# EAGLE design OBD-UART-ng (EAGLE 9.6.2)
DESCRIPTION: microOBD 200 OBD-II Module; HW_REV: 1.4; PCB_REV: C; PCB_SPEC1: Layer Count: 4; PCB_SPEC2: Size: 1.3" x 0.59"; PCB_SPEC3: Finish Thickness: 0.049" - 0.052"; PCB_SPEC4: Copper Weight: 1oz; TITLE: STM1120

## Sheet 1 of 5
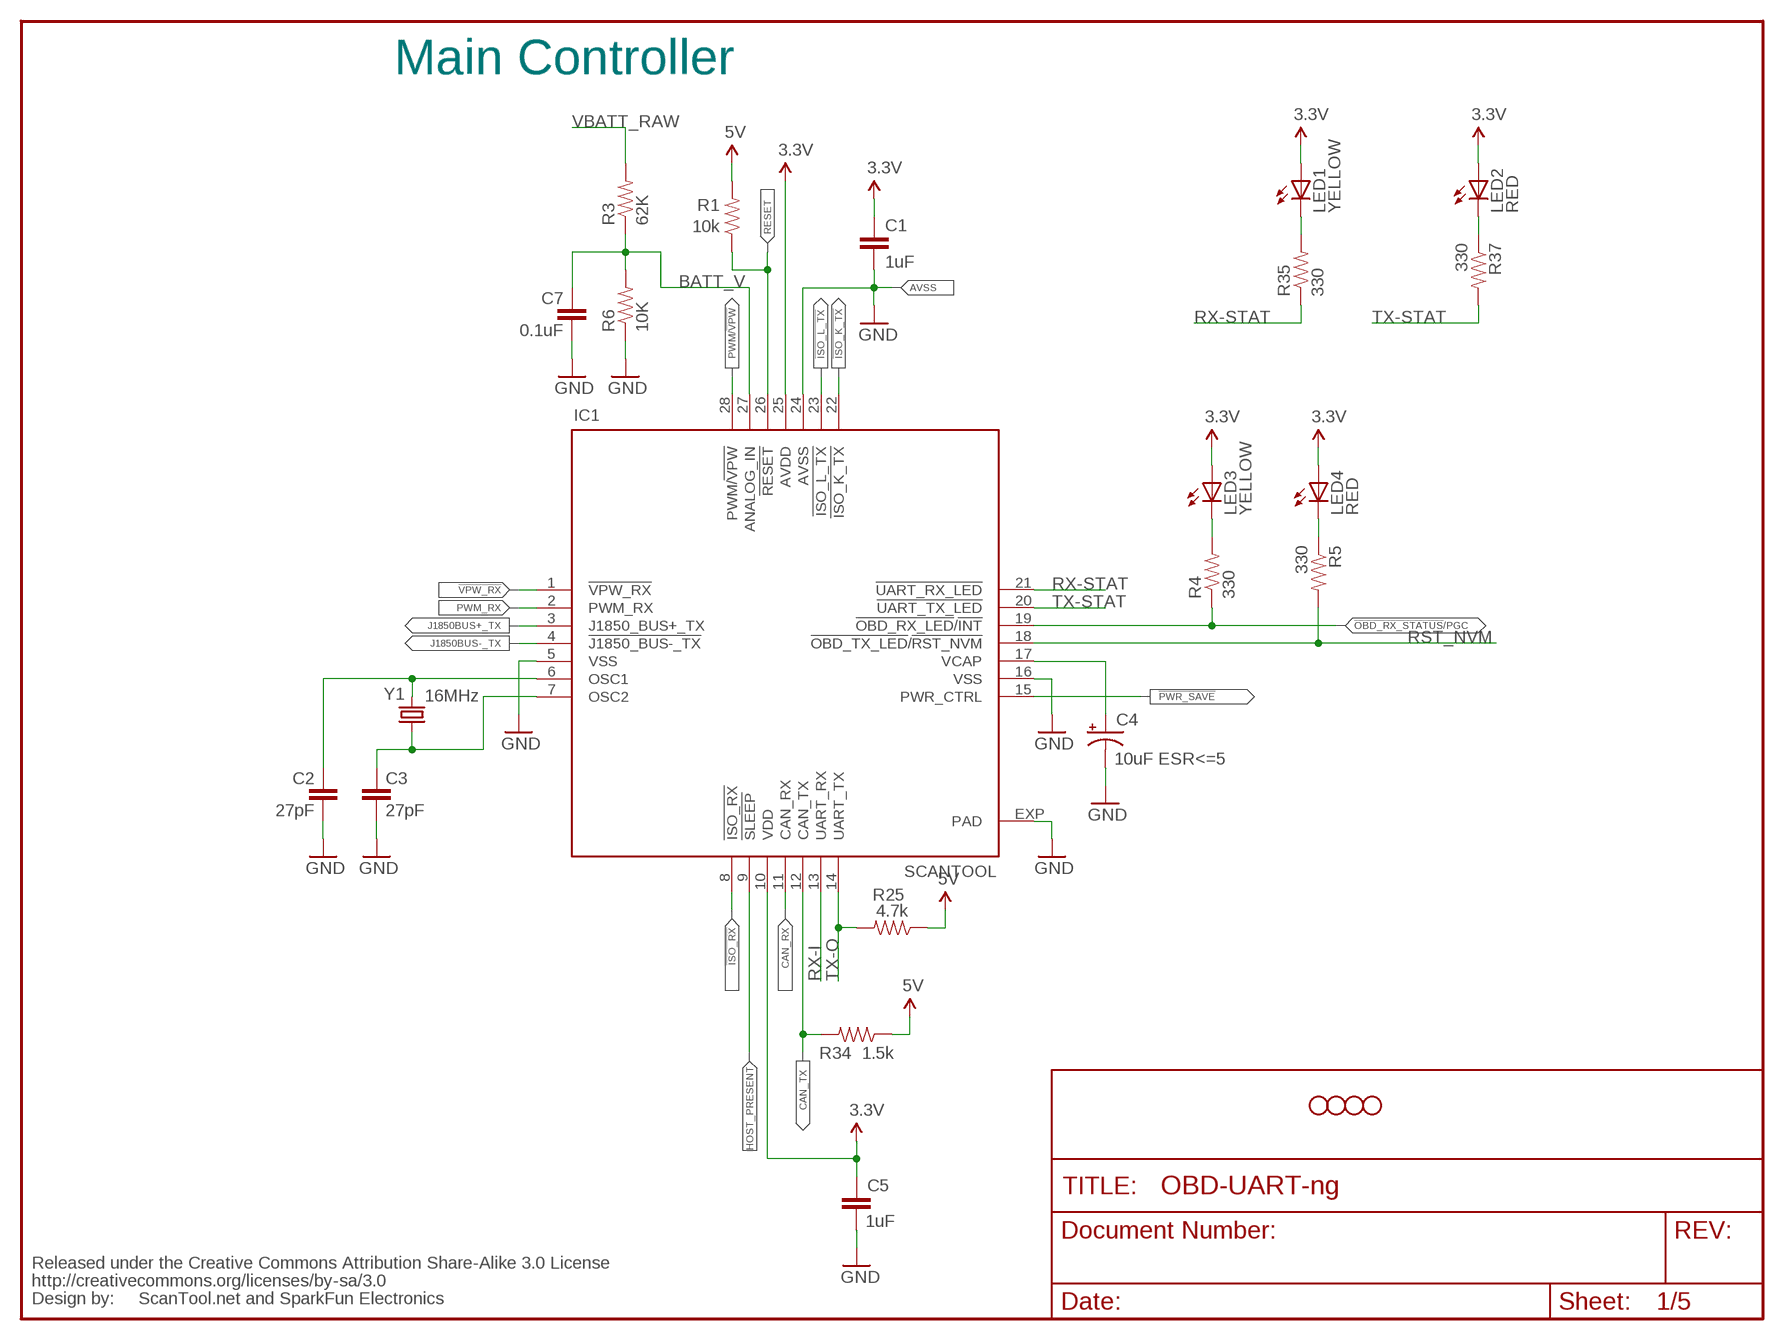
[diagram p0: schematic, sheet 1]

### Parts
C1  1uF  CAP0402-CAP  [0402-CAP]
C2  27pF  CAP0402-CAP  [0402-CAP]
C3  27pF  CAP0402-CAP  [0402-CAP]
C4  10uF ESR<=5  CAP_POL1206  [EIA3216]
C5  1uF  CAP0402-CAP  [0402-CAP]
C7  0.1uF  CAP0402-CAP  [0402-CAP]
IC1  SCANTOOL  [_STN_SCANTOOL_QFN-28-S]
JP4  STAND-OFF  [STAND-OFF]
JP5  STAND-OFF  [STAND-OFF]
JP6  STAND-OFF  [STAND-OFF]
JP7  STAND-OFF  [STAND-OFF]
LED1  YELLOW  LED0603  [LED-0603]
LED2  RED  LED0603  [LED-0603]
LED3  YELLOW  LED0603  [LED-0603]
LED4  RED  LED0603  [LED-0603]
R1  10k  RESISTOR0402-RES  [0402-RES]
R3  62K  RESISTOR0402-RES  [0402-RES]
R4  330  RESISTOR0402-RES  [0402-RES]
R5  330  RESISTOR0402-RES  [0402-RES]
R6  10K  RESISTOR0402-RES  [0402-RES]
R25  4.7k  RESISTOR0402-RES  [0402-RES]
R34  1.5k  RESISTOR0402-RES  [0402-RES]
R35  330  RESISTOR0402-RES  [0402-RES]
R37  330  RESISTOR0402-RES  [0402-RES]
U$1  CREATIVE_COMMONS  [CREATIVE_COMMONS]
Y1  16MHz  CRYSTAL5X3  [CRYSTAL-SMD-5X3]

### Nets
3.3V [highpower]: C1.1 C5.1 IC1.10(VDD) IC1.25(AVDD) LED1.A LED2.A LED3.A LED4.A ; also sheet 2,3,4,5
5V [highpower]: R1.2 R25.1 R34.1 ; also sheet 2,3,4
!ISO_K_TX: IC1.22(!ISO_K_TX) ; also sheet 3
!ISO_L_TX: IC1.23(!ISO_L_TX) ; also sheet 3
!ISO_RX: IC1.8(!ISO_RX) ; also sheet 3
!OBD_RX_STATUS!/PGC: IC1.19(!OBD_RX_LED!/!INT) R4.1
!PWR_SAVE: IC1.15(PWR_CTRL)
!VPW_RX: IC1.1(!VPW_RX) ; also sheet 4
BATT_V [highpower]: C7.1 IC1.27(ANALOG_IN) R3.1 R6.2
CAN_RX: IC1.11(CAN_RX) ; also sheet 3
CAN_TX: IC1.12(CAN_TX) R34.2 ; also sheet 3
GND: C1.2 C2.2 C3.2 C4.C(-) C5.2 C7.2 IC1.5(VSS) IC1.16(VSS) IC1.24(AVSS) IC1.EXP(PAD) R6.1 ; also sheet 2,3,4,5
HOST_PRESENT: IC1.9(!SLEEP)
J1850BUS+_TX: IC1.3(J1850_BUS+_TX) ; also sheet 4
J1850BUS-_TX: IC1.4(!J1850_BUS-_TX) ; also sheet 4
N$26: C4.A(+) IC1.17(VCAP)
N$30: LED3.C R4.2
N$31: LED4.C R5.1
N$35: LED1.C R35.2
N$36: LED2.C R37.1
OSC1: C2.1 IC1.6(OSC1) Y1.3
OSC2: C3.1 IC1.7(OSC2) Y1.1
PWM/!VPW: IC1.28(PWM/!VPW) ; also sheet 4
PWM_RX: IC1.2(PWM_RX) ; also sheet 4
RESET: IC1.26(!RESET) R1.1
RST_NVM: IC1.18(!OBD_TX_LED!/!RST_NVM) R5.2
RX-I: IC1.13(UART_RX) ; also sheet 2
RX-STAT: IC1.21(!UART_RX_LED) R35.1
TX-O: IC1.14(UART_TX) R25.2 ; also sheet 2
TX-STAT: IC1.20(!UART_TX_LED) R37.2
VBATT_RAW [highpower]: R3.2 ; also sheet 2

### Notes on the sheet
- Main Controller
- AVSS
- ScanTool.net and SparkFun Electronics

## Sheet 2 of 5
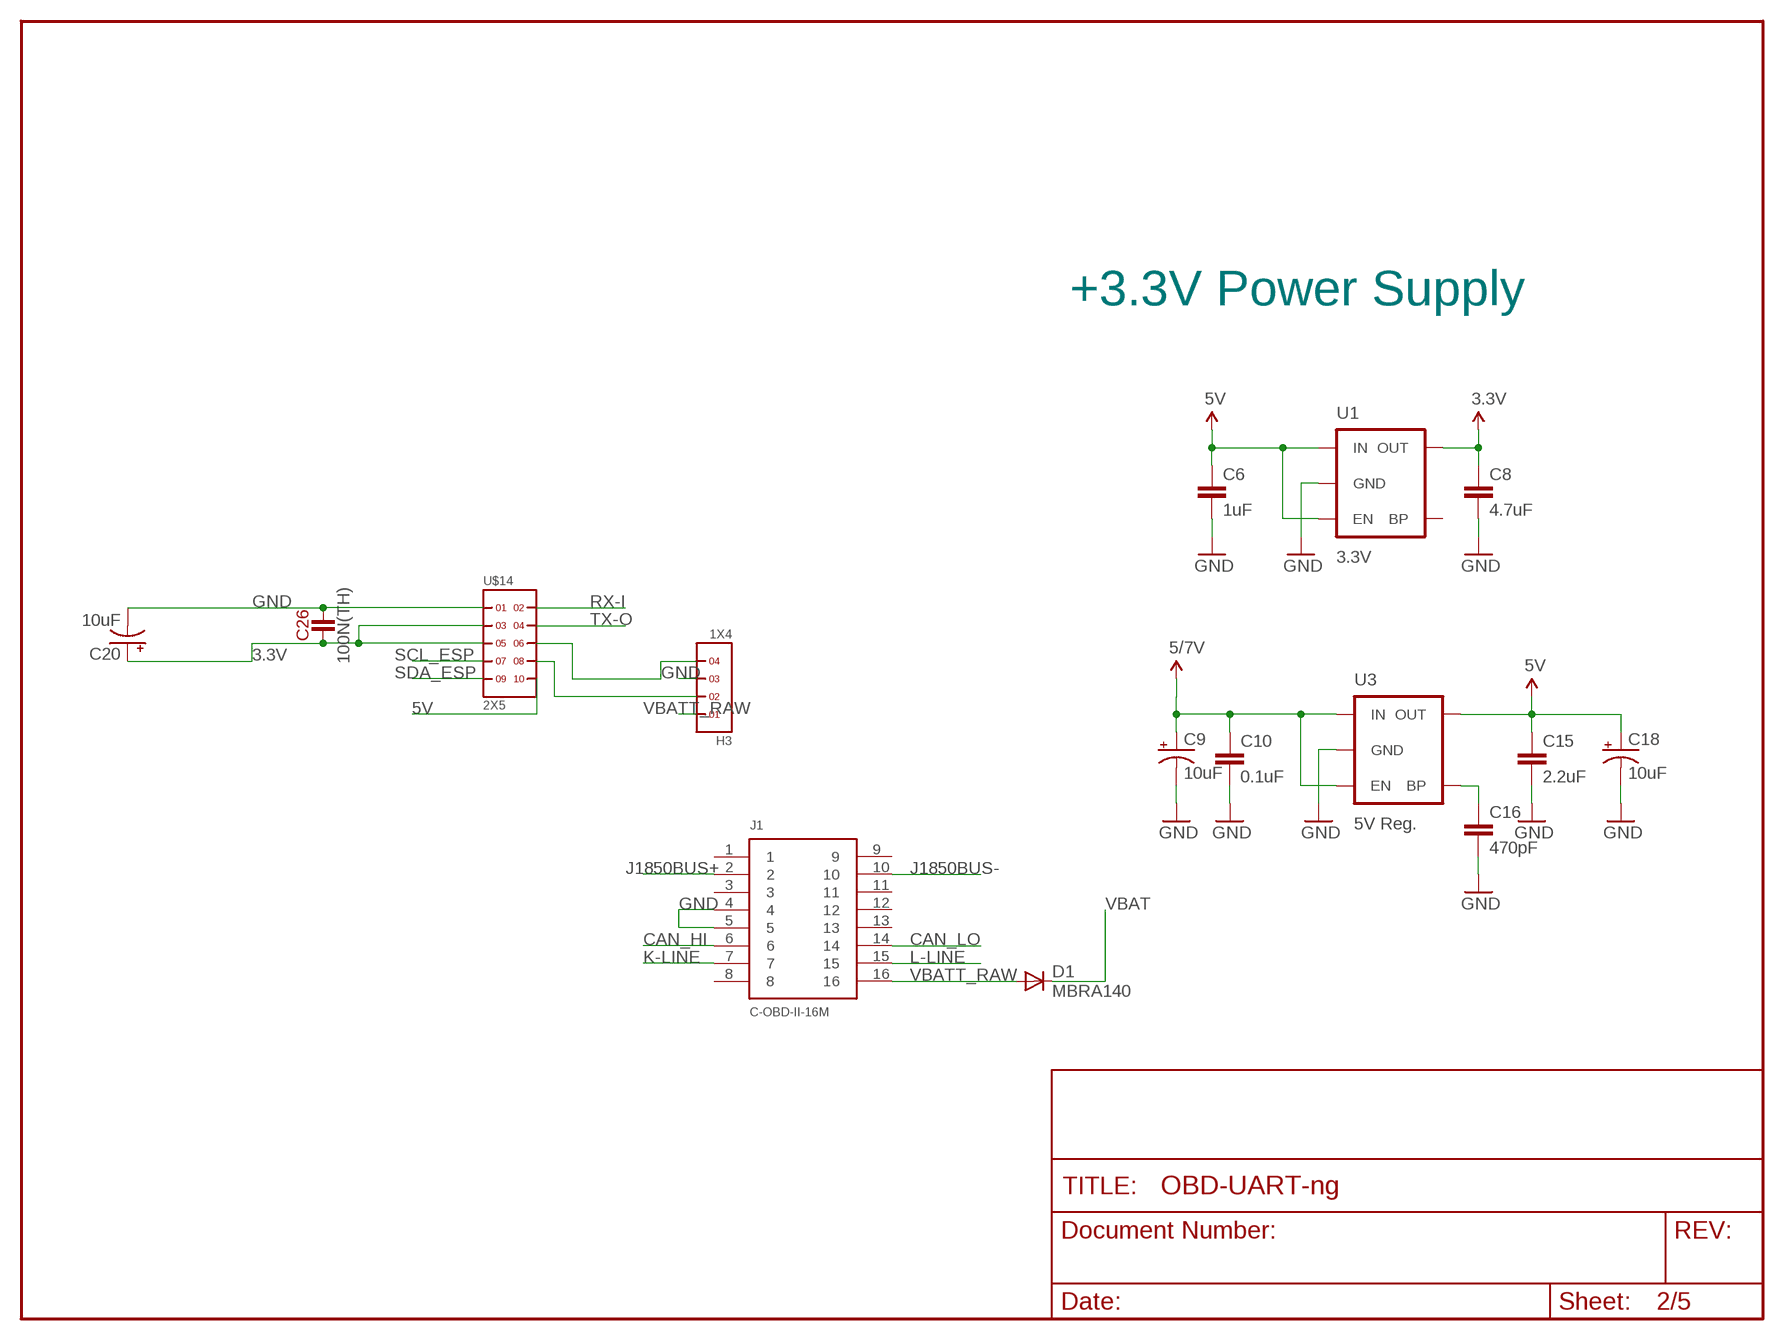
[diagram p1: schematic, sheet 2]

### Parts
C6  1uF  CAP0402-CAP  [0402-CAP]
C8  4.7uF  CAP0402-CAP  [0402-CAP]
C9  10uF  CAP_POL1206  [EIA3216]
C10  0.1uF  CAP0402-CAP  [0402-CAP]
C15  2.2uF  CAP0402-CAP  [0402-CAP]
C16  470pF  CAP0402-CAP  [0402-CAP]
C18  10uF  CAP_POL1206  [EIA3216]
C20  10uF  CAP_POL1206  [EIA3216]
C26  100N(TH)  [C050-024X044]
D1  MBRA140  DIODESMA  [SMA-DIODE]
H3  1X4  [1X4]
J1  C-OBD-II-16M  [COMTECH_C-OBD-II-16M]
U1  3.3V  V_REG_LDOSMD  [SOT23-5]
U3  5V Reg.  V_REG_LDOSMD  [SOT23-5]
U$14  2X5  [2X5]

### Nets
3.3V [highpower]: C8.1 C20.A(+) C26.1 U1.5(OUT) U$14.3 U$14.5 ; also sheet 1,3,4,5
5V [highpower]: C6.1 C15.1 C18.A(+) U1.1(IN) U1.3(EN) U3.5(OUT) U$14.10 ; also sheet 1,3,4
CAN_HI: J1.6 ; also sheet 3
CAN_LO: J1.14 ; also sheet 3
GND: C6.2 C8.2 C9.C(-) C10.2 C15.2 C16.2 C18.C(-) C20.C(-) C26.2 H3.3 J1.4 J1.5 U1.2(GND) U3.2(GND) U$14.1 ; also sheet 1,3,4,5
J1850BUS+: J1.2 ; also sheet 4
J1850BUS-: J1.10 ; also sheet 4
K-LINE: J1.7 ; also sheet 3
L-LINE: J1.15 ; also sheet 3
N$17: H3.4 U$14.6
N$20: H3.2 U$14.8
N$34: C16.1 U3.4(BP)
RX-I: U$14.2 ; also sheet 1
SCL_ESP: U$14.7 ; also sheet 5
SDA_ESP: U$14.9 ; also sheet 5
TX-O: U$14.4 ; also sheet 1
VBAT [highpower]: D1.C ; also sheet 3,4
VBATT_RAW [highpower]: D1.A H3.1 J1.16 ; also sheet 1
VCC [highpower]: C9.A(+) C10.1 U3.1(IN) U3.3(EN) ; supply symbol labelled 5/7V ; also sheet 4
Unconnected: J1.1 J1.3 J1.8 J1.9 J1.11 J1.12 J1.13 U1.4(BP)

### Notes on the sheet
- +3.3V Power Supply

## Sheet 3 of 5
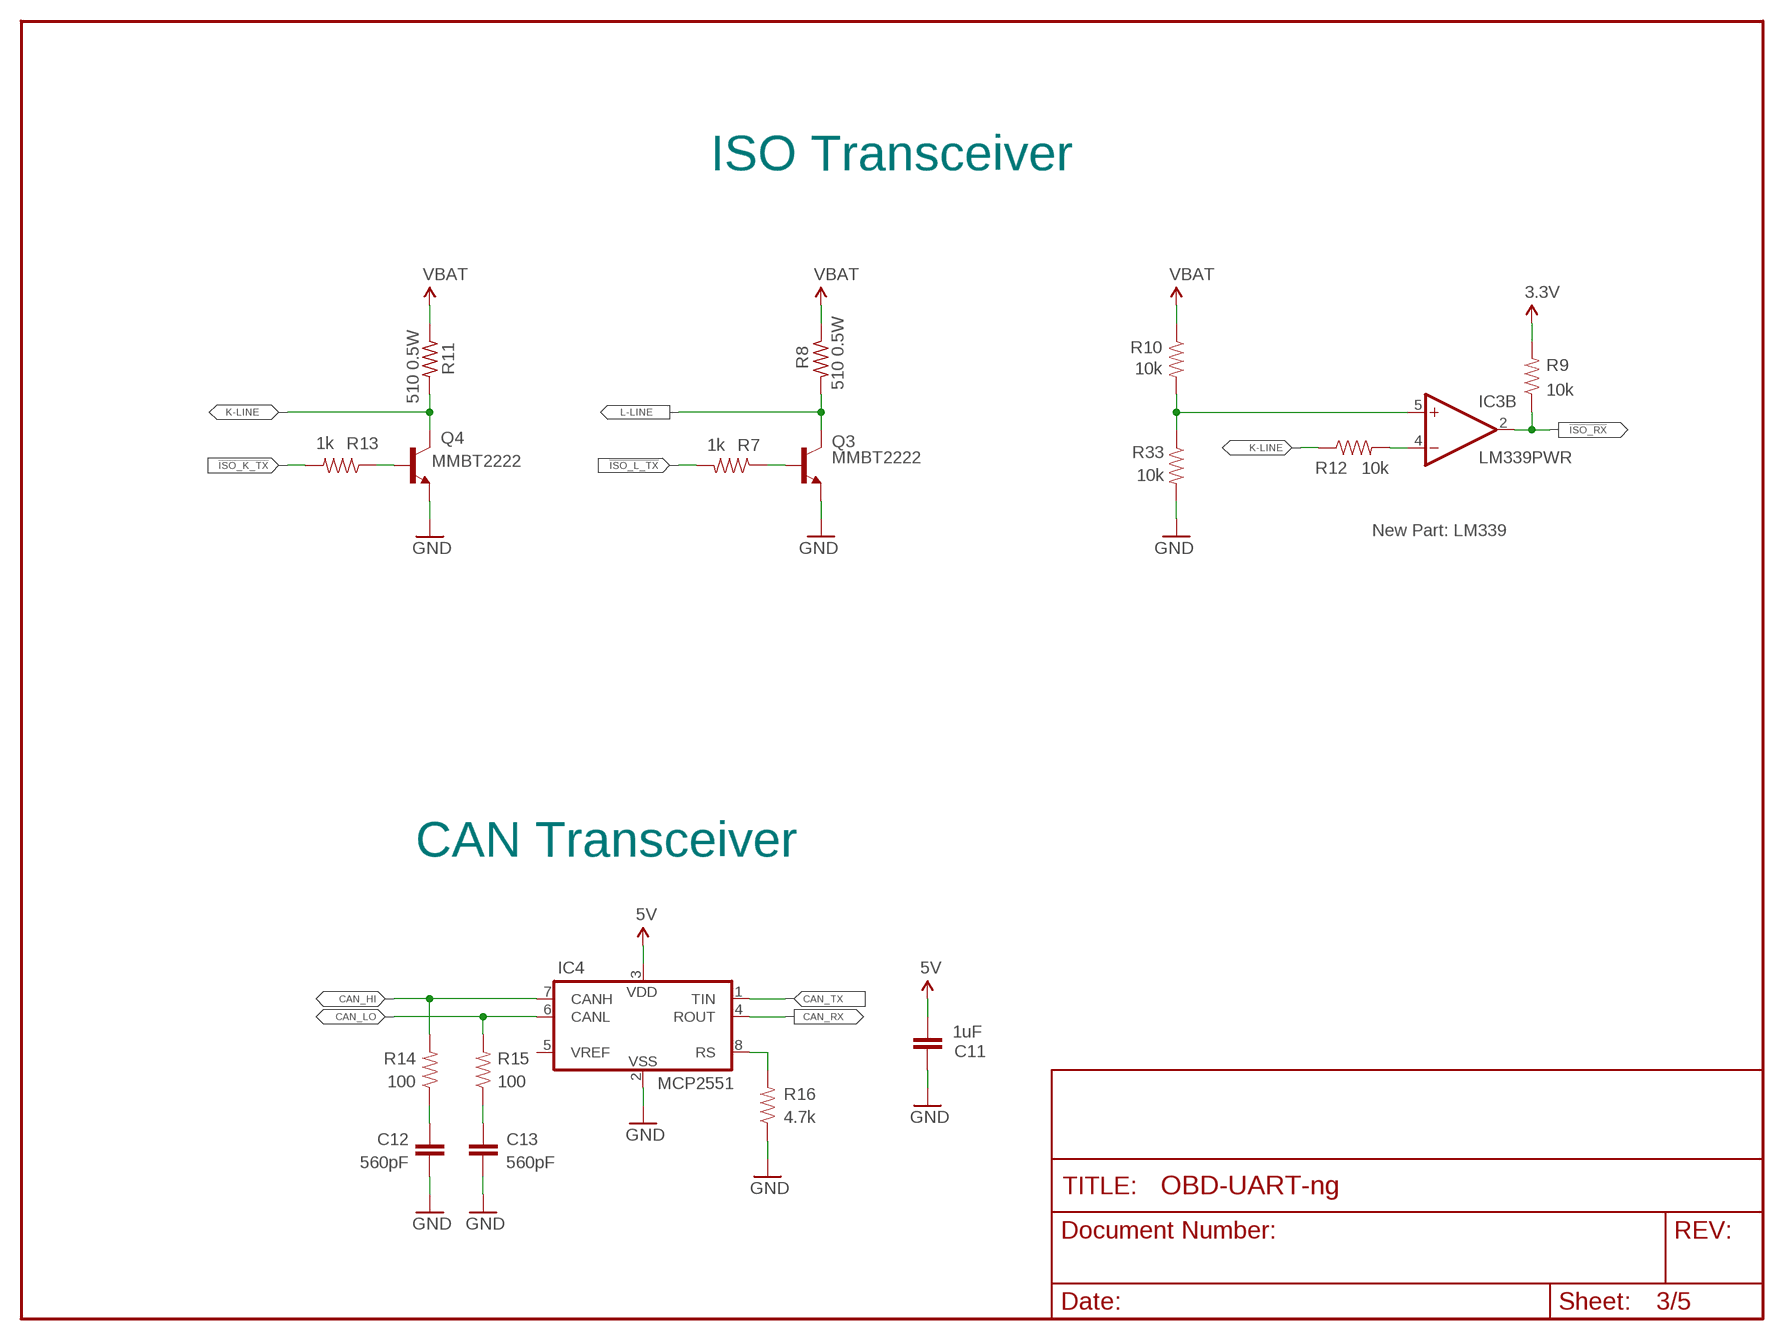
[diagram p2: schematic, sheet 3]

### Parts
C11  1uF  CAP0402-CAP  [0402-CAP]
C12  560pF  CAP0402-CAP  [0402-CAP]
C13  560pF  CAP0402-CAP  [0402-CAP]
IC3  LM339PWR  [TSSOP-14]
IC4  MCP2551  MCP2551-I/SN  [SO-8]
Q3  MMBT2222  TRANSISTOR_NPNSOT23-3  [SOT23-3]
Q4  MMBT2222  TRANSISTOR_NPNSOT23-3  [SOT23-3]
R7  1k  RESISTOR0402-RES  [0402-RES]
R8  510 0.5W  R-US_2010  [2010]
R9  10k  RESISTOR0402-RES  [0402-RES]
R10  10k  RESISTOR0402-RES  [0402-RES]
R11  510 0.5W  R-US_2010  [2010]
R12  10k  RESISTOR0402-RES  [0402-RES]
R13  1k  RESISTOR0402-RES  [0402-RES]
R14  100  RESISTOR0402-RES  [0402-RES]
R15  100  RESISTOR0402-RES  [0402-RES]
R16  4.7k  RESISTOR0402-RES  [0402-RES]
R33  10k  RESISTOR0402-RES  [0402-RES]

### Nets
3.3V [highpower]: R9.2 ; also sheet 1,2,4,5
5V [highpower]: C11.1 IC4.3(VDD) ; also sheet 1,2,4
!ISO_K_TX: R13.2 ; also sheet 1
!ISO_L_TX: R7.2 ; also sheet 1
!ISO_RX: IC3.2(B:OUT) R9.1 ; also sheet 1
CAN_HI: IC4.7(CANH) R14.2 ; also sheet 2
CAN_LO: IC4.6(CANL) R15.2 ; also sheet 2
CAN_RX: IC4.4(ROUT) ; also sheet 1
CAN_TX: IC4.1(TIN) ; also sheet 1
GND: C11.2 C12.2 C13.2 IC4.2(VSS) Q3.2(E) Q4.2(E) R16.1 R33.2 ; also sheet 1,2,4,5
K-LINE: Q4.3(C) R11.2 R12.1 ; also sheet 2
L-LINE: Q3.3(C) R8.2 ; also sheet 2
N$4: Q4.1(B) R13.1
N$5: Q3.1(B) R7.1
N$6: IC3.5(B:+IN) R10.2 R33.1
N$10: C12.1 R14.1
N$11: IC4.8(RS) R16.2
N$13: IC3.4(B:-IN) R12.2
N$27: C13.1 R15.1
VBAT [highpower]: R8.1 R10.1 R11.1 ; also sheet 2,4
Unconnected: IC3.10(D:-IN) IC3.11(D:+IN) IC3.13(D:OUT) IC4.5(VREF)

### Notes on the sheet
- ISO Transceiver
- New Part: LM339
- CAN Transceiver

## Sheet 4 of 5
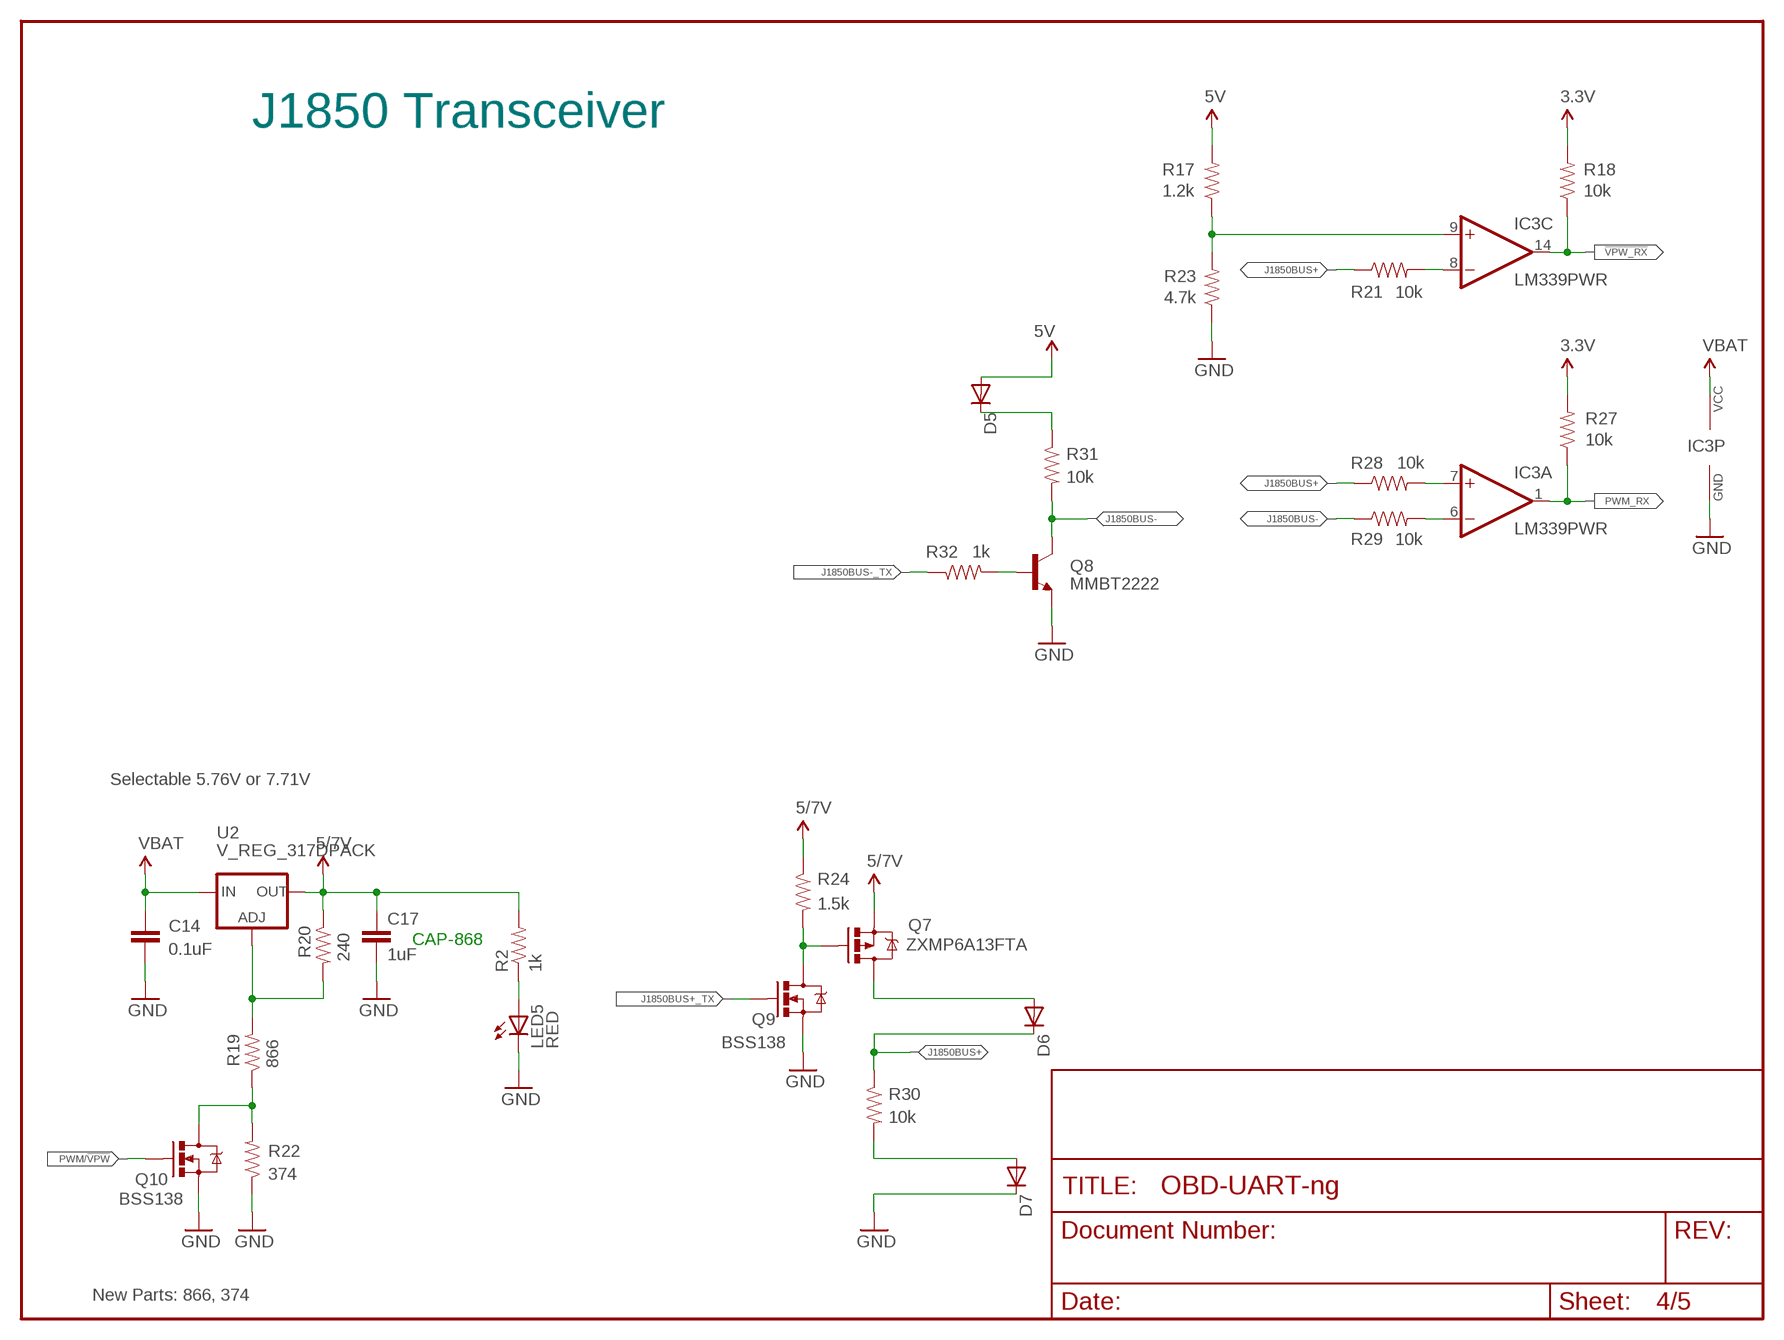
[diagram p3: schematic, sheet 4]

### Parts
C14  0.1uF  CAP0402-CAP  [0402-CAP]
C17  1uF  CAP0402-CAP  [0402-CAP]
D5  DIODESOT23  [SOT23-3]
D6  DIODESOT23  [SOT23-3]
D7  DIODESOT23  [SOT23-3]
LED5  RED  LED0603  [LED-0603]
Q7  ZXMP6A13FTA  MOSFET-PCHANNEL  [SOT23]
Q8  MMBT2222  TRANSISTOR_NPNSOT23-3  [SOT23-3]
Q9  BSS138  MOSFET-NCHANNELSMD  [SOT23-3]
Q10  BSS138  MOSFET-NCHANNELSMD  [SOT23-3]
R2  1k  RESISTOR0402-RES  [0402-RES]
R17  1.2k  RESISTOR0402-RES  [0402-RES]
R18  10k  RESISTOR0402-RES  [0402-RES]
R19  866  RESISTOR0402-RES  [0402-RES]
R20  240  RESISTOR0402-RES  [0402-RES]
R21  10k  RESISTOR0402-RES  [0402-RES]
R22  374  RESISTOR0402-RES  [0402-RES]
R23  4.7k  RESISTOR0402-RES  [0402-RES]
R24  1.5k  RESISTOR0402-RES  [0402-RES]
R27  10k  RESISTOR0402-RES  [0402-RES]
R28  10k  RESISTOR0402-RES  [0402-RES]
R29  10k  RESISTOR0402-RES  [0402-RES]
R30  10k  RESISTOR0402-RES  [0402-RES]
R31  10k  RESISTOR0402-RES  [0402-RES]
R32  1k  RESISTOR0402-RES  [0402-RES]
U2  V_REG_317DPACK  [V-REG_DPACK]

### Nets
3.3V [highpower]: R18.2 R27.2 ; also sheet 1,2,3,5
5V [highpower]: D5.1(A) R17.2 ; also sheet 1,2,3
!VPW_RX: IC3.14(C:OUT) R18.1 ; also sheet 1
GND: C14.2 C17.2 D7.3(C) IC3.12(P:GND) LED5.C Q8.2(E) Q9.2(S) Q10.2(S) R22.1 R23.1 ; also sheet 1,2,3,5
J1850BUS+: D6.3(C) R21.1 R28.1 R30.1 ; also sheet 2
J1850BUS+_TX: Q9.1(G) ; also sheet 1
J1850BUS-: Q8.3(C) R29.1 R31.2 ; also sheet 2
J1850BUS-_TX: R32.1 ; also sheet 1
N$1: IC3.7(A:+IN) R28.2
N$3: IC3.6(A:-IN) R29.2
N$7: IC3.8(C:-IN) R21.2
N$8: R19.2 R20.2 U2.1(ADJ)
N$9: D6.1(A) Q7.3(D)
N$12: IC3.9(C:+IN) R17.1 R23.2
N$14: D5.3(C) R31.1
N$18: Q7.1(G) Q9.3(D) R24.2
N$22: Q10.3(D) R19.1 R22.2
N$24: D7.1(A) R30.2
N$25: Q8.1(B) R32.2
N$32: LED5.A R2.1
PWM/!VPW: Q10.1(G) ; also sheet 1
PWM_RX: IC3.1(A:OUT) R27.1 ; also sheet 1
VBAT [highpower]: C14.1 IC3.3(P:VCC) U2.3(IN) ; also sheet 2,3
VCC [highpower]: C17.1 Q7.2(S) R2.2 R20.1 R24.1 U2.4(OUT) ; supply symbol labelled 5/7V ; also sheet 2

### Notes on the sheet
- J1850 Transceiver
- Selectable 5.76V or 7.71V
- CAP-868
- New Parts: 866, 374

## Sheet 5 of 5
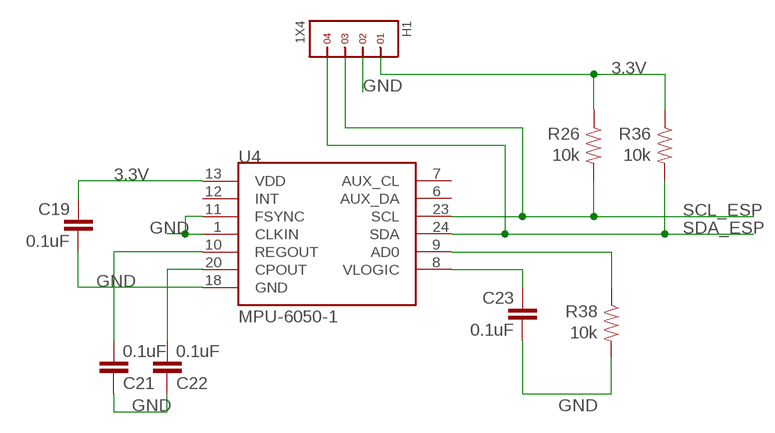
[diagram p4: schematic, sheet 5]

### Parts
C19  0.1uF  CAP0402-CAP  [0402-CAP]
C21  0.1uF  CAP0402-CAP  [0402-CAP]
C22  0.1uF  CAP0402-CAP  [0402-CAP]
C23  0.1uF  CAP0402-CAP  [0402-CAP]
H1  1X4  [1X4]
R26  10k  RESISTOR0402-RES  [0402-RES]
R36  10k  RESISTOR0402-RES  [0402-RES]
R38  10k  RESISTOR0402-RES  [0402-RES]
U4  MPU-6050-1  [QFN-24-4MM2]

### Nets
3.3V [highpower]: C19.1 H1.1 R26.1 R36.1 U4.13(VDD) ; also sheet 1,2,3,4
GND: C19.2 C21.1 C22.1 C23.2 H1.2 R38.2 U4.1(CLKIN) U4.11(FSYNC) U4.18(GND) ; also sheet 1,2,3,4
N$15: C21.2 U4.10(REGOUT)
N$16: C22.2 U4.20(CPOUT)
N$23: R38.1 U4.9(AD0)
N$28: C23.1 U4.8(VLOGIC)
SCL_ESP: H1.3 R26.2 U4.23(SCL) ; also sheet 2
SDA_ESP: H1.4 R36.2 U4.24(SDA) ; also sheet 2
Unconnected: U4.6(AUX_DA) U4.7(AUX_CL) U4.12(INT)

## Library data of the parts
C1-C3 C5-C8 C10-C17 C19 C21-C23 = SparkFun:CAP: Capacitor Standard 0603 ceramic capacitor, and 0.1" leaded capacitor.
C4 C9 C18 C20 = SparkFun:CAP_POL: Capacitor Polarized These are standard SMD and PTH capacitors. Normally 10uF, 47uF, and 100uF in electrolytic and tantalum varieties. Always verify the external diameter of the through hole cap, it varies with capacity, voltage, and manufacturer. The EIA devices should be standard.
C26 = capacitors:?; MOUSER: 81-RCER71H104K0A2H3B
D1 D5-D7 = SparkFun:DIODE: Diode These are standard reverse protection diodes and small signal diodes. SMA package can handle up to about 1A. SOD-323 can handle about 200mA. What the SOD-323 package when ordering, there are some mfgs out there that are 5-pin packages.
H1 H3 = headers(.1in):1X4
IC1 = SparkFun:SCANTOOL: STN1110 - Multiprotocol OBD II to UART Interpreter, QFN Package Change Log Date Author Change Aug 23, 2010 vit@scantool.net Created device
IC3 = _stn_logic:LM339PWR: Quad Differential Comparators Based on information from the SLCS006N datasheet from TI (www.ti.com). Change Log Date Author Change July 16, 2008 nick@scantool.net Device created.; DESC: IC, Quad Comparator; MANUF: Texas Instruments; PARTNUM: LM339PWR; SUPPLIER: Digikey:296-6607-1-ND; VALSTAT: PARTNUM
IC4 = _stn_microchip:MCP2551: CAN Driver Based on information from the MPC2551 datasheet from Microchip. http://www.microchip.com/ Change Log Date Author Change November 12, 2008 joe@scantool.net Renamed "TXD" to "TIN" and "RXD" to "ROUT" Fixed mislabeled pins "CANH" and CANL"; DESC: IC, CAN Transceiver; MANUF: Microchip Technology; PARTNUM: MCP2551-I/SN; SUPPLIER: Digikey:MCP2551-I/SN-ND; VALSTAT: PARTNUM
J1 = C-OBD-II-16M:C-OBD-II-16M: OBD II 16pin 90 Degree Angle Male Plug Connector Check availability <https://pricing.snapeda.com/parts/C-OBD-II-16M/Comtech%20Electronic%20Co.%2C%20LTD/view-part?ref=eda>; AVAILABILITY: Not in stock; DESCRIPTION: OBD II 16pin 90 Degree Angle Male Plug Connector; MF: Comtech Electronic Co., LTD; MP: C-OBD-II-16M; PACKAGE: None; PRICE: None
JP4-JP7 = SparkFun:STAND-OFF: Stand Off This is the mechanical footprint for a #4 phillips button head screw. Use the keepout ring to avoid running the screw head into surrounding components. SKU : PRT-00447
LED1-LED5 = SparkFun:LED: LEDs Standard schematic elements and footprints for 5mm, 3mm, 1206, and 0603 sized LEDs. 5mm - Spark Fun Electronics SKU : COM-00529 (and others)
Q3 Q4 Q8 = SparkFun:TRANSISTOR_NPN: Transistor NPN BJT configuration in SOT23 package. MMBT2222 is the common NPN we use. Double check BCE configuration again layout.
Q7 = SparkFun:MOSFET-PCHANNEL
Q9 Q10 = SparkFun:MOSFET-NCHANNEL
R1-R7 R9 R10 R12-R38 = SparkFun:RESISTOR: Resistor Basic schematic elements and footprints for 0603, 1206, and PTH resistors.
R8 R11 = _stn_rcl:R-US: Resistor, US Symbol Change Log Date Author Change November 13, 2006 vit@scantool.net Moved underscore from the end of device name to beginning of variant names. May 27, 2006 vitaliy@scantool.net Added description.; DESC: Resistor; VALSTAT: VAL
U1 U3 = SparkFun:V_REG_LDO: Voltage Regulator LDO Standard 150mA LDO voltage regulator in SOT-23 layout. Micrel part MIC5205. BP (by-pass) pin is used to lower output noise with 470pF cap.
U2 = SparkFun:V_REG_317: Voltage Regulator Standard LM317 adjustable voltage regulator. AOI (Adjust Output Input). Google 'LM317 Calculator' for easy to use app to get the two resistor values needed. 240/720 for 5V output. 240/390 for 3.3V output. Spark Fun Electronics SKU : COM-00527
U4 = Testing:MPU-6050
U$1 = SparkFun:CREATIVE_COMMONS
U$14 = headers(2mm):2X5
Y1 = SparkFun:CRYSTAL: Crystals Various standard crystals. Proven footprints. Spark Fun Electronics SKU : COM-00534

## Net classes
1 highpower: width 0.356 mm

## Board
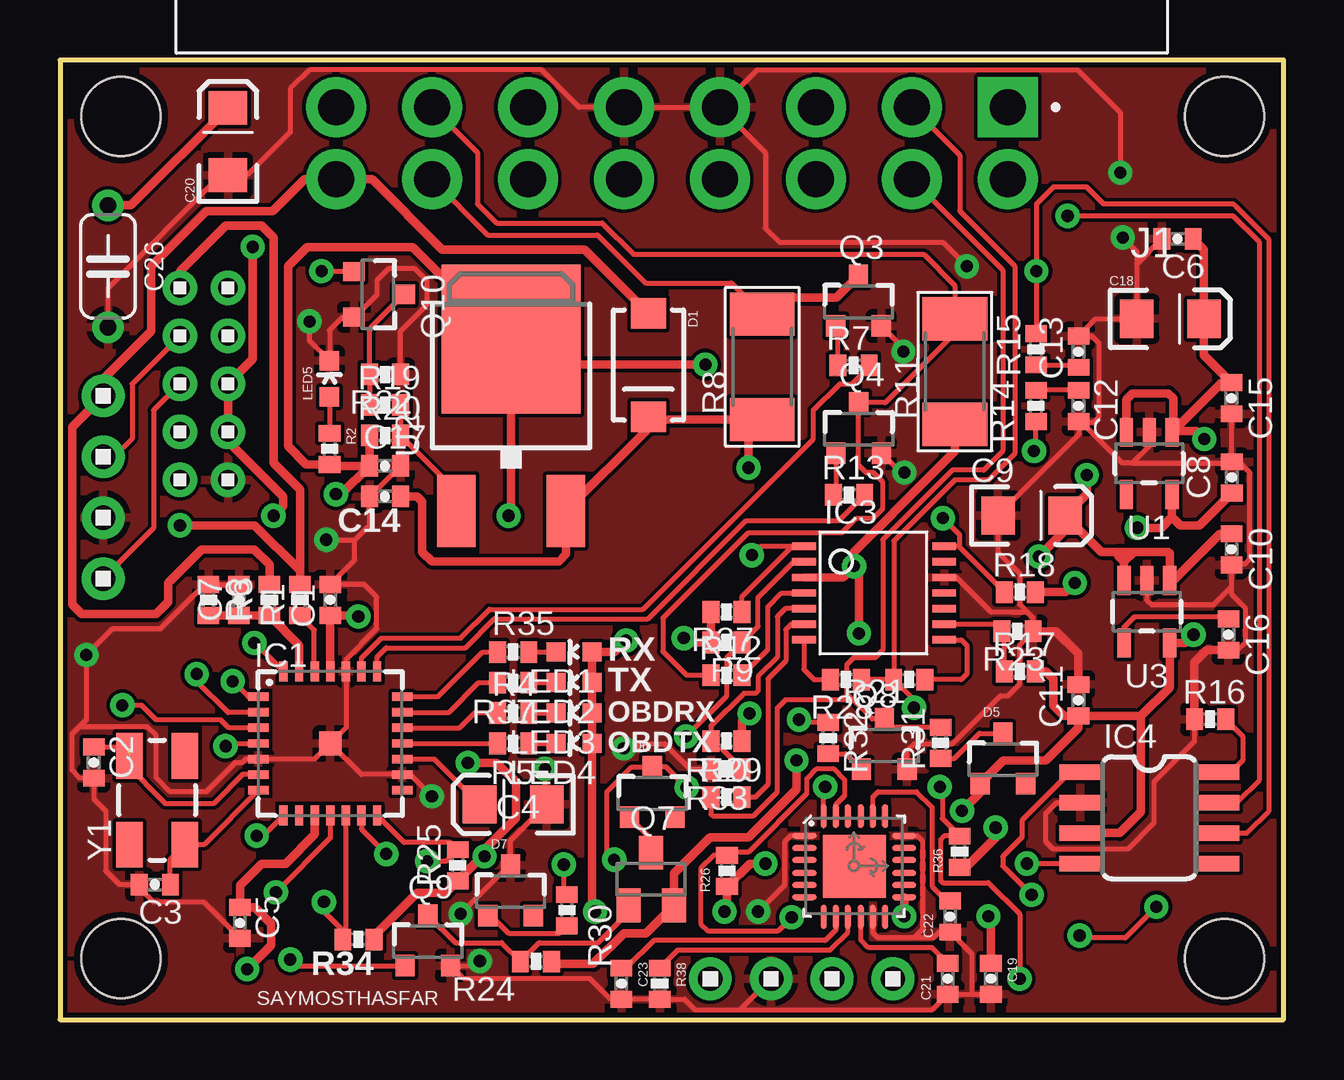
[diagram p5: board, top side]
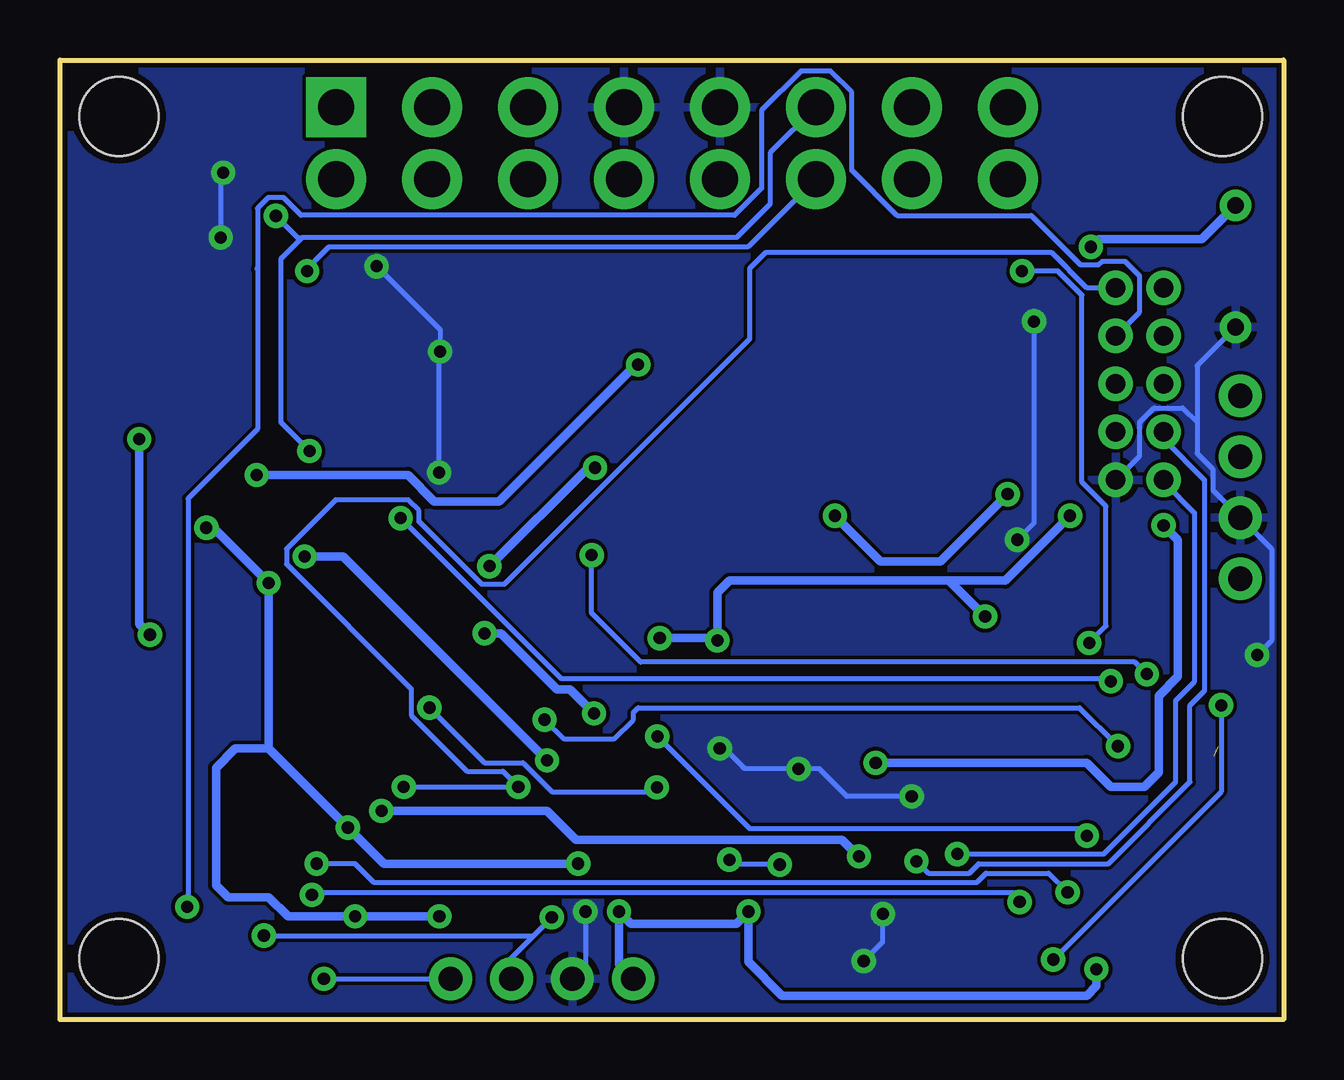
[diagram p6: board, bottom side, seen from below]

Size 51 x 40 mm. Coordinates in mm from the lower left corner, seen from the top.
Outline: 0,0 51,0 51,40 0,40 0,0
Copper layers (1*16): Top 0.035mm / dielectric 1.5mm / Bottom 0.035mm
Design rules "SparkFun *": minimum track width 8mil, minimum drill 20mil, track to track 6mil, track to pad 6mil, pad to pad 6mil, via to via 6mil, smd to smd 6mil, copper to edge 8mil, drill to drill 8mil, minimum pad ring 12mil, minimum via ring 10mil, stop-mask expansion 4mil, vias tented up to drill 20mil, thermal gap 10mil
Milling: 4 lines

### Footprints (pad centres in the part's own frame; a part is rotated, then mirrored left to right if it is on the bottom)
0402-CAP = smd 0.7 x 0.9: 1 -0.65,0; 2 0.65,0
EIA3216 = smd 1.4 x 1.6: A 1.4,0; C -1.4,0
C050-024X044 = drill 0.7: 1 -2.54,0; 2 2.54,0
SMA-DIODE = smd 1.27 x 1.47: A -2.15,0; C 2.15,0
SOT23-3 = smd 0.8 x 0.9: 1 -0.95,-1; 2 0.95,-1; 3 0,1.1
1X4 = drill 1.016 pad 1.778: 1 0,0; 2 2.54,0; 3 5.08,0; 4 7.62,0
_STN_SCANTOOL_QFN-28-S = smd 0.85 x 0.35: 1 -3,1.95; 2 -3,1.3; 3 -3,0.65; 4 -3,0; 5 -3,-0.65; 6 -3,-1.3; 7 -3,-1.95; 15 3,-1.95; 16 3,-1.3; 17 3,-0.65; 18 3,0; 19 3,0.65; 20 3,1.3; 21 3,1.95 | smd 0.35 x 0.85: 8 -1.95,-3; 9 -1.3,-3; 10 -0.65,-3; 11 0,-3; 12 0.65,-3; 13 1.3,-3; 14 1.95,-3; 22 1.95,3; 23 1.3,3; 24 0.65,3; 25 0,3; 26 -0.65,3; 27 -1.3,3; 28 -1.95,3 | smd 1 x 1: EXP 0,0
TSSOP-14 = smd 0.305 x 0.991: 1 -1.95,-2.925; 2 -1.3,-2.925; 3 -0.65,-2.925; 4 0,-2.925; 5 0.65,-2.925; 6 1.3,-2.925; 7 1.95,-2.925; 8 1.95,2.925; 9 1.3,2.925; 10 0.65,2.925; 11 0,2.925; 12 -0.65,2.925; 13 -1.3,2.925; 14 -1.95,2.925
SO-8 = smd 0.65 x 1.75: 1 -1.905,-2.873; 2 -0.635,-2.873; 3 0.635,-2.873; 4 1.905,-2.873; 5 1.905,2.873; 6 0.635,2.873; 7 -0.635,2.873; 8 -1.905,2.873
COMTECH_C-OBD-II-16M = drill 1.5 pad 2.5 square: 1 0,0 | drill 1.5 pad 2.5: 2 4,0; 3 8,0; 4 12,0; 5 16,0; 6 20,0; 7 24,0; 8 28,0; 9 0,3; 10 4,3; 11 8,3; 12 12,3; 13 16,3; 14 20,3; 15 24,3; 16 28,3
STAND-OFF = hole 3.302: 0,0
LED-0603 = smd 0.8 x 0.8: A 0,-0.75; C 0,0.75
SOT23 = smd 1 x 1.4: 1 -0.95,-1.1; 2 0.95,-1.1; 3 0,1.1
0402-RES = smd 0.7 x 0.9: 1 -0.65,0; 2 0.65,0
2010 = smd 1.8 x 2.7: 1 -2.2,0; 2 2.2,0
SOT23-5 = smd 0.55 x 1.2: 1 -0.95,-1.3; 2 0,-1.3; 3 0.95,-1.3; 4 0.95,1.3; 5 -0.95,1.3
V-REG_DPACK = smd 1.6 x 3: 1 -2.28,-4.8; 3 2.28,-4.8 | smd 5.8 x 6.2: 4 0,2.38
QFN-24-4MM2 = smd 1.016 x 0.254: 1 -2.066,1.257; 2 -2.066,0.75; 3 -2.066,0.247; 4 -2.066,-0.287; 5 -2.066,-0.792; 6 -2.066,-1.297; 13 2.086,-1.297; 14 2.086,-0.792; 15 2.086,-0.287; 16 2.086,0.247; 17 2.086,0.75; 18 2.086,1.257 | smd 0.254 x 1.016: 7 -1.267,-2.122; 8 -0.762,-2.122; 9 -0.258,-2.122; 10 0.278,-2.122; 11 0.78,-2.122; 12 1.287,-2.122; 19 1.287,2.082; 20 0.78,2.082; 21 0.278,2.082; 22 -0.258,2.082; 23 -0.762,2.082; 24 -1.267,2.082 | smd 2.616 x 2.616: P$1 0.02,-0.01
2X5 = drill 0.8 pad 1.422: 1 -4,-1; 2 -4,1; 3 -2,-1; 4 -2,1; 5 0,-1; 6 0,1; 7 2,-1; 8 2,1; 9 4,-1; 10 4,1
CRYSTAL-SMD-5X3 = smd 1.9 x 1.1: 1 -1.85,-1.15; 2 1.85,-1.15; 3 1.85,1.15; 4 -1.85,1.15

### Placement (x,y rotation side)
C1  11.27,17.49 90 top
C2  1.41,10.71 270 top
C3  3.95,5.63 180 top
C4  18.89,8.97 180 top
C5  7.5,4.03 270 top
C6  46.58,32.54 180 top
C7  7.46,17.49 90 top
C8  48.84,22.6 90 top
C9  40.5,21.01 0 top
C10  48.83,19.6 270 top
C11  42.45,13.31 90 top
C12  42.45,25.58 270 top
C13  42.45,27.84 90 top
C14  13.55,21.81 180 top
C15  48.83,25.9 270 top
C16  48.7,16.05 270 top
C17  13.55,23.08 0 top
C18  46.28,29.21 0 top
C19  38.8,1.7 270 top
C20  7,36.6 90 top
C21  37,1.7 90 top
C22  37.1,4.3 90 top
C23  23.4,1.5 270 top
C26  2,31.4 270 top
D1  24.53,27.28 270 top
D5  39.3,10.83 0 top
D6  24.69,9.43 0 top
D7  18.78,5.33 0 top
H1  27.1,1.7 0 top
H3  1.8,26 270 top
IC1  11.27,11.51 0 top
IC3  33.93,17.78 270 top
IC4  45.4,8.41 270 top
J1  39.5,38.03 180 top
JP4  2.54,2.54 0 top
JP5  48.54,37.64 0 top
JP6  48.54,2.54 0 top
JP7  2.54,37.64 0 top
LED1  21.43,15.32 90 top
LED2  21.43,14.05 90 top
LED3  21.43,12.78 90 top
LED4  21.43,11.51 90 top
LED5  11.23,26.71 0 top
Q3  33.28,29.91 0 top
Q4  33.29,24.61 0 top
Q7  24.64,5.86 0 top
Q8  34.36,11.43 0 top
Q9  15.33,3.25 0 top
Q10  13.25,30.23 270 top
R1  10,17.49 90 top
R2  11.24,23.79 270 top
R3  8.73,17.49 90 top
R4  18.89,12.78 0 top
R5  18.89,11.51 180 top
R6  6.19,17.49 270 top
R7  33.08,27.27 0 top
R8  29.27,27.21 90 top
R9  27.78,15.72 180 top
R10  27.78,11.61 180 top
R11  37.3,27.01 90 top
R12  27.78,14.35 0 top
R13  32.89,21.87 0 top
R14  40.68,25.58 270 top
R15  40.68,27.94 90 top
R16  47.94,12.52 0 top
R17  40.01,14.51 0 top
R18  40.01,17.82 0 top
R19  13.55,25.62 0 top
R20  13.55,24.35 0 top
R21  35.4,14.17 0 top
R22  13.55,26.89 180 top
R23  39.91,16.18 180 top
R24  19.84,2.42 180 top
R25  16.58,6.43 90 top
R26  27.8,6.2 90 top
R27  27.78,16.99 180 top
R28  32.76,14.17 180 top
R29  27.78,9.27 0 top
R30  21.13,4.56 270 top
R31  36.7,11.53 90 top
R32  32.02,11.73 270 top
R33  27.78,10.44 180 top
R34  12.44,3.34 180 top
R35  18.89,15.32 0 top
R36  37.5,7 90 top
R37  18.89,14.05 180 top
R38  25,1.5 270 top
U1  45.4,23.18 180 top
U2  18.8,25.99 0 top
U3  45.3,17 180 top
U4  33.1,6.4 0 top
U$1  20.32,-15.24 0 top  (outside the outline)
U$14  6,26.5 90 top
Y1  4.05,9.14 90 top

### Tracks (layer width: path | path; a pad name or v marks a point on that pad's centre or on a via)
3.3V  (via drill 0.51)
  Top 0.356: IC1.25 C1.1 12.4,16.84 v12.44,16.8 | U1.5 46.35,20.95 | 46.35,20.95 46.7,20.6 47.49,20.6 C8.1 | R18.2 41.92,17.82 v42.3,18.2 | v44.9,20.5 45.9,20.5 46.35,20.95 | v39,8 39,7.6 37.75,6.35 R36.1 | v29.4,6.5 28.75,6.5 R26.1 27.8,4.6 v27.7,4.5 | C26.1 2.94,33.94 C20.A | IC1.10 10.62,7.72 9.4,6.5 8.4,6.5 7.5,5.6 C5.1 8.12,4.68 8.8,4 8.8,3.1 v7.8,2.1 | R27.2 R9.2 26.18,15.72 v26,15.9 | v8.9,21 9.3,21.4 9.3,21.8 7,24.1 U$14.3 U$14.5 8.04,27.54 8.04,32.2 v8.03,32.21 | v23.6,15.8 23.12,15.32 LED1.A LED2.A LED3.A LED4.A 22.18,4.62 v22.3,4.5 | v35.19,4.3 U4.13 | v38.7,4.3 38.8,4.2 C19.1
  Bottom 0.356: v44.9,20.5 44.6,20.5 v42.3,18.2 42.3,11.3 | 42.3,11.3 v39,8 37.5,6.5 v29.4,6.5 | H1.1 27.7,2.3 v27.7,4.5 27.2,4 22.8,4 v22.3,4.5 22.3,2.4 20.9,1 8.2,1 7.8,1.4 v7.8,2.1 | v8.9,21 11.6,18.3 13.94,18.3 | 13.94,18.3 23.1,18.3 23.6,17.8 v23.6,15.8 23.7,15.9 v26,15.9 | v12.44,16.8 13.94,18.3 | v8.03,32.21 7.7,32.54 3.4,32.54 C26.1 | 42.3,11.3 43.7,11.3 44.5,10.5 44.5,5.6 44,5.1 42.3,5.1 41.5,4.3 v38.7,4.3 v35.19,4.3
5V  (via drill 0.51)
  Top 0.356: U1.3 44.45,25.85 44.7,26.1 46.2,26.1 46.4,25.9 46.4,24.53 | R17.2 41.09,14.51 41.4,14.2 41.4,13.1 41.84,12.66 C11.1 | C11.1 45.06,12.66 | 45.06,12.66 46.25,13.85 U3.5 46.91,15.7 v47.25,16.04 | 45.06,12.66 45.06,8.66 44.17,7.78 IC4.3 | C11.1 42.45,12.15 41.1,10.8 39.32,10.8 D5.1 38.35,9.45 v37.6,8.7 | R34.1 13.09,3.49 14.88,5.28 16.08,5.28 R25.1 17.6,6.8 v17.7,6.8 17.7,7.1 19,8.4 19,9.9 18.2,10.7 v17,10.7 | C6.1 47.68,32.09 C18.A 47.68,27.69 C15.1 48.42,26.55 46.4,24.53 | U1.1 46.4,24.53 | v47.7,24.2 47.37,24.53 46.4,24.53 | R1.2 10,18.71 | U$14.10 5,31.2 6.9,33.1 8.4,33.1 8.9,32.6 8.9,23.2 10,22.1 10,18.71 | v5,20.6 8.12,20.6 10,18.71
  Bottom 0.356: v47.25,16.04 47.7,16.48 v47.7,24.2 | v17.7,6.8 18.4,7.5 29.5,7.5 30.7,8.7 v37.6,8.7 | v17,10.7 8.2,10.7 7.2,9.7 5.8,9.7 5.2,10.3 5.2,13.5 4.4,14.3 4.4,20 v5,20.6
!ISO_K_TX
  Top 0.203: IC1.22 13.22,15.12 13.6,15.5 16.9,15.5 18.1,16.7 24.5,16.7 28.6,20.8 32.47,20.8 R13.2
!ISO_L_TX
  Top 0.203: IC1.23 12.57,15.07 13.4,15.9 16.7,15.9 17.9,17.1 24.3,17.1 31.4,24.2 31.4,25.4 32.5,26.5 33,26.5 33.73,27.23 R7.2
!ISO_RX  (via drill 0.51)
  Top 0.203: IC3.2 30.58,19.08 29.1,17.6 29.1,16.39 R9.1 27.8,15.09 27.8,13.5 v26.1,11.8 | IC1.8 8.47,7.66 v8.2,7.66
  Bottom 0.203: v8.2,7.66 8.5,7.96 22.26,7.96 v26.1,11.8
!OBD_RX_STATUS!/PGC
  Top 0.203: IC1.19 16.66,12.16 17.3,12.8 18.22,12.8 R4.1
!VPW_RX  (via drill 0.51)
  Top 0.203: IC3.14 37.45,19.73 37.49,19.69 | 37.49,19.69 R18.1 | IC1.1 7.84,13.46 v7.2,14.1 | v36.8,20.9 37.49,20.21 37.49,19.69
  Bottom 0.203: v7.2,14.1 7.3,14.2 30.1,14.2 v36.8,20.9
BATT_V
  Top 0.356: IC1.27 9.97,15.6 R3.1 C7.1 R6.2
CAN_HI  (via drill 0.51)
  Top 0.203: v40.6,23.7 40.68,23.78 R14.2 | IC4.7 49.05,9.04 50,10 50,32.4 48.9,33.5 v42,33.5
  Bottom 0.203: J1.6 21.4,36.13 21.4,34 22.8,32.6 40.9,32.6 | 40.9,32.6 41.8,31.7 41.8,24.9 v40.6,23.7 | v42,33.5 41.1,32.6 40.9,32.6
CAN_LO  (via drill 0.51)
  Top 0.203: R15.2 40.7,28.61 v40.7,31.2 40.7,34 41.4,34.7 42.8,34.7 43.5,34 48.9,34 49.04,33.86 49.05,33.86 50.4,32.5 50.4,8.7 49.48,7.78 IC4.6
  Bottom 0.203: J1.14 22.33,32.2 39.8,32.2 40.7,31.3 v40.7,31.2
CAN_RX  (via drill 0.51)
  Top 0.203: IC1.11 11.27,7.57 v9,5.3 | v40.3,6.5 IC4.4
  Bottom 0.203: v9,5.3 9.8,6.1 12.4,6.1 12.8,5.7 37.9,5.7 38.7,6.5 v40.3,6.5
CAN_TX  (via drill 0.51)
  Top 0.203: IC1.12 11.92,3.47 R34.2 11.79,3.71 11,4.5 v11,4.9 | v40.5,5.2 39.3,6.4 39.3,6.8 40.1,7.6 40.1,8.3 42.12,10.31 IC4.1 42.02,10.31
  Bottom 0.203: v11,4.9 11,5.1 11.2,5.3 40.4,5.3 v40.5,5.2
GND  (via drill 0.51)
  Top 0.203: C6.2 44.88,31.49 | 44.88,31.49 C18.C 43.17,29.21 C13.2 43.01,28.49 43.3,28.2 43.3,25.1 43.09,24.89 42.49,24.89 | C15.2 48.83,23.27 C8.2 48.8,23.2 | U1.2 45.4,23.9 44.7,23.2 | 44.7,23.2 44.28,23.2 42.49,24.99 42.49,24.89 | 42.49,24.89 C12.2 | 44.7,23.2 48.8,23.2 | U3.2 45.3,17.5 45.5,17.3 48.1,17.3 48.83,18.03 | 48.83,18.03 C10.2 48.88,19 49.4,19 49.6,19.2 49.6,22.8 49.2,23.2 48.8,23.2 | 48.83,18.03 48.83,17.73 49.41,17.15 49.41,16.24 49.4,16.24 49.4,15.7 49.1,15.4 C16.2 | IC3.12 37.37,18.43 38.8,17 40.3,17 | 40.3,17 40.56,16.74 R23.1 40,15.62 40,13.99 39.51,13.5 39.2,13.5 37.2,11.5 35.6,11.5 35.31,11.21 Q8.2 | R16.1 47.29,11.59 45.6,9.9 45.6,8.2 44.5,7.1 41.4,7.1 41.1,7.4 41.1,8.6 41.55,9.04 IC4.2 | H1.2 28.35,0.41 | 28.35,0.41 26.48,0.41 26.03,0.85 R38.2 C23.2 22.95,0.85 22.1,1.7 16.83,1.7 Q9.2 17.31,2.25 v17.5,2.44 | 38,1.05 C21.1 36.36,0.41 28.35,0.41 | 38,1.05 C19.2 | 38,1.05 38,2.75 C22.1 36.65,3.65 36.4,3.4 35.6,3.4 | 35.6,3.4 34.1,3.4 33.88,3.62 U4.11 | 35.3,7.66 U4.18 35.73,7.66 35.95,7.44 35.95,5.25 35.95,3.75 35.6,3.4 | R33.2 26.26,10.44 25.2,11.5 24.2,11.5 24,11.3 v23.5,11.3 | 42.49,24.89 42.49,24.4 C9.C 39.1,19.5 40,18.6 40,17.3 40.3,17 | J1.4 J1.5 21.63,38.03 20.06,39.59 10.4,39.59 9.6,38.79 9.6,37 7.8,35.2 C20.C 6.7,35.2 2,30.5 C26.2 | J1.4 29.4,36.13 29.4,33 30,32.4 36.8,32.4 v37.8,31.4 | v35.16,27.84 35.16,27.98 Q3.2 | Q4.2 35.05,22.8 v35.2,22.8 | C17.2 12.93,21.81 C14.2 12.9,20.61 12.29,20 | C7.2 R6.1 6.04,18.14 4.2,16.3 2.2,16.3 v1.1,15.2 1.1,12.5 0.8,12.2 | IC1.EXP 11.92,12.16 IC1.24 11.92,15.02 13.2,16.3 13.2,17.61 12.67,18.14 C1.2 12.29,19.16 12.29,20
  Top 0.203: IC1.EXP 10.62,10.86 IC1.5 7.76,10.86 7.6,10.7 7.3,10.7 6.1,9.5 4.6,9.5 4,10.1 4,11.84 3.64,12.2 0.8,12.2 | IC1.EXP 12.57,10.21 IC1.16 14.59,10.21 v15.5,9.3 | C5.2 5.98,4.9 3.9,4.9 3.3,5.5 C3.2 2.47,5.63 1.9,6.2 1.9,8.7 1.41,9.19 C2.2 0.84,10.06 0.5,10.4 0.5,11.9 0.8,12.2 | J1.4 29.06,39.59 42.41,39.59 44.2,37.8 v44.2,35.3 | v44.3,32.6 44.88,32.02 44.88,31.49 | R22.1 14.2,28.7 15.3,29.8 15.3,30.8 14.8,31.3 13.7,31.3 13.2,30.8 13.2,30.2 12.28,29.28 Q10.2 11.78,29.28 11.23,28.73 LED5.C 10.4,28.29 v10.4,29.1 | v16.7,4.4 17.18,4.88 18.72,6.43 D7.3 18.78,7.46 C4.C 20.5,8.97 20.21,9.26 v20.21,10.45 | v11.1,20 12.29,20 | U4.1 30.46,7.66 30.2,7.4 30.2,5.6 v29.1,4.5
  Top 0.356: R23.1 41.52,16.18 42.45,15.25 C11.2 | C16.2 47.8,15.4 47.29,14.89 R16.1
  Bottom 0.203: v37.8,31.4 35.16,28.76 v35.16,27.84 35.2,27.8 v35.2,22.8 | v44.2,35.3 44.3,35.2 v44.3,32.6 | v1.1,15.2 0.5,15.8 0.5,19.62 H3.3 2.94,22.06 2.94,22.95 3.6,23.6 3.6,24.9 | v17.5,2.44 16.7,3.24 v16.7,4.4 | v15.5,9.3 18.2,9.3 19.35,10.45 v20.21,10.45 22.45,10.45 23.3,11.3 v23.5,11.3 | U$14.1 6,23.5 6,24.9 5.4,25.5 4.2,25.5 3.6,24.9 | v10.4,29.1 10.4,20.7 v11.1,20 | C26.2 3.6,27.26 3.6,24.9 | v29.1,4.5 29.1,2.24 H1.2
  pour Top: -0.9,40.5 51.4,40.5 51.9,40 51.9,0 51.2,-0.7 -0.2,-0.7 -0.5,-1 -0.5,40 -0.9,40.4
  pour Bottom: -1.2,41.6 -0.7,42.1 50.5,42.1 51.3,42.1 53,40.4 53.4,40 53.4,-1.1 51.8,-2.7 50.4,-2.7 -0.7,-2.7 -2.5,-0.9 -2.5,40.3
J1850BUS+  (via drill 0.51)
  Top 0.203: J1.2 37.5,36.03 37.5,33.7 39.8,31.4 39.8,23.6 38.7,22.5 37.3,22.5 34.75,19.95 R21.1 | R21.1 R28.1 | R21.1 35.6,13.32 v35.6,13 | v26.12,9.68 25.27,10.53 D6.3 23.83,10.53 22.8,9.5 22.8,6.96 v23.1,6.66 | R30.1 21,5.34 v21,6.46
  Bottom 0.203: v35.6,13 33.3,10.7 31.7,10.7 30.5,9.5 26.3,9.5 v26.12,9.68 | v21,6.46 22.9,6.46 v23.1,6.66
J1850BUS+_TX  (via drill 0.51)
  Top 0.203: v9.6,2.5 9.85,2.25 Q9.1 | v2.6,13.1 3.4,13.1 4,12.5 6.7,12.5 7.04,12.16 IC1.3
  Bottom 0.203: v2.6,13.1 2.6,9.5 v9.6,2.5
J1850BUS-
  Top 0.203: J1.10 39.3,31.23 39.3,23.7 38.5,22.9 37.2,22.9 34.3,20 34.3,15.4 34,15.1 33.1,15.1 32.8,14.8 32.8,13.59 33.06,13.33 | R31.2 34.42,12.18 34.36,12.24 Q8.3 33.86,12.53 33.06,13.33 | R29.1 27.13,8.57 27.2,8.5 28.9,8.5 29.9,9.5 29.9,13 30.23,13.33 33.06,13.33
J1850BUS-_TX  (via drill 0.51)
  Top 0.203: R32.1 30.92,12.38 v30.8,12.5 | IC1.4 7,11.5 v6.9,11.4
  Bottom 0.203: v6.9,11.4 8.5,13 26.9,13 27.1,12.8 27.1,12.5 27.9,11.7 30,11.7 v30.8,12.5
K-LINE
  Top 0.203: J1.7 17.4,36.13 17.4,34 18.2,33.2 22.6,33.2 23.9,31.9 36,31.9 37.3,30.6 R11.2 37.3,28.61 34.4,25.71 Q4.3 33.29,23.11 33.6,22.8 33.9,22.8 34.3,22.4 34.3,21.3 33.9,20.9 33.2,20.9 32.6,20.3 28.7,20.3 25.13,16.73 25.13,15.35 26.13,14.35 R12.1
L-LINE
  Top 0.203: J1.15 17.83,32.7 22.4,32.7 24.4,30.7 27.98,30.7 R8.2
  Top 0.356: R8.2 29.96,30.1 32.37,30.1 Q3.3
N$1
  Top 0.203: IC3.7 31,14.6 31.43,14.17 R28.2
N$3
  Top 0.203: IC3.6 30.48,16.48 30.26,16.26 30.26,14.95 29.5,14.2 29.5,9.8 28.97,9.27 R29.2
N$4
  Top 0.203: Q4.1 32.34,21.97 R13.1
N$5
  Top 0.203: R7.1 32.43,28.81 Q3.1
N$6
  Top 0.203: IC3.5 30.23,17.13 29.9,16.8 29.9,15.1 29.1,14.3 29.1,13.7 29,13.6 28.5,13.6 27.13,12.23 R10.2 27.26,11.61 R33.1
N$7
  Top 0.203: IC3.8 37.57,15.83 37.8,15.6 37.8,14.4 37.57,14.17 R21.2
N$8
  Top 0.203: R19.2 R20.2 16.52,22.03 U2.1
N$9
  Top 0.203: D6.1 24.64,7.53 Q7.3
N$10
  Top 0.203: C12.1 R14.1
N$11
  Top 0.203: R16.2 49.3,11.81 49.3,10.8 48.81,10.31 IC4.8
N$12
  Top 0.203: IC3.9 38.96,16.48 R23.2 39.36,16.08 R17.1
N$13
  Top 0.203: R12.2 29.5,15.42 29.5,17.2 30.08,17.78 IC3.4
N$14
  Top 0.203: R31.1 37.28,10.88 38.33,11.93 D5.3
N$15
  Top 0.203: C21.2 36.35,3 33.7,3 33.38,3.32 U4.10
N$16
  Top 0.203: U4.20 33.88,9.28 34.1,9.5 35.7,9.5 36.34,8.86 36.34,5.56 36.8,5.1 36.95,5.1 C22.2
N$17
  Top 0.203: U$14.6 3.9,25.4 3.9,20.48 H3.4
N$18
  Top 0.203: Q9.3 16.48,3.2 18.41,3.2 R24.2 19.97,3.2 22.43,3.2 23.69,4.46 Q7.1
N$20
  Top 0.203: U$14.8 3,26.5 3,24.2 2.26,23.46 H3.2
N$22
  Top 0.203: R19.1 R22.2 12.9,28.72 12.95,28.77 12.95,28.83 Q10.3
N$23
  Top 0.203: R38.1 25.75,2.9 32.1,2.9 32.84,3.64 U4.9
N$24
  Top 0.203: D7.1 17.97,4.33 18.7,3.6 20.82,3.6 R30.2
N$25
  Top 0.203: R32.2 32.76,11.08 Q8.1
N$26
  Top 0.203: IC1.17 15.6,10.86 C4.A
N$27
  Top 0.203: R15.1 42.35,27.29 C13.1
N$28
  Top 0.203: U4.8 32.34,3.74 31.9,3.3 24.75,3.3 23.6,2.15 C23.1
N$30
  Top 0.203: R4.2 LED3.C
N$31
  Top 0.203: R5.1 LED4.C
N$32
  Top 0.203: LED5.A R2.1
N$34
  Top 0.203: U3.4 44.35,16.35 44.8,16.8 48.6,16.8 C16.1
N$35
  Top 0.203: R35.2 LED1.C
N$36
  Top 0.203: R37.1 LED2.C
OSC1  (1 unrouted)
  Top 0.203: C2.1 2.53,11.36 Y1.3 | IC1.6 7.61,10.21 6.4,9 4.4,9 2.73,10.67 2.73,11.36
OSC2
  Top 0.203: C3.1 4.6,6.69 Y1.1 6,7.29 IC1.7
PWM/!VPW  (via drill 0.51)
  Top 0.203: IC1.28 8.13,15.7 v8.1,15.7 | v10.9,31.2 12.23,31.2 Q10.1
  Bottom 0.203: v8.1,15.7 7.4,16.4 7.4,21.4 8.4,22.4 8.4,30.2 9.4,31.2 v10.9,31.2
PWM_RX  (via drill 0.51)
  Top 0.203: R27.1 28.43,17.63 30.53,19.73 | 30.53,19.73 IC3.1 | v28.84,19.36 29.21,19.73 30.53,19.73 | IC1.2 7,12.8 5.7,14.1 v5.7,14.4
  Bottom 0.203: v5.7,14.4 6.2,14.9 26.8,14.9 28.84,16.94 v28.84,19.36
RESET
  Top 0.203: IC1.26 10.6,14.53 10.6,16.24 R1.1
RST_NVM
  Top 0.203: IC1.18 R5.2
RX-I  (via drill 0.51)
  Top 0.203: IC1.13 12.57,7.93 v13.6,6.9
  Bottom 0.203: v13.6,6.9 7.5,6.9 4.5,9.9 4.5,13.3 3.7,14.1 3.7,21.1 5,22.4 U$14.2
RX-STAT
  Top 0.203: IC1.21 15.76,13.46 17.62,15.32 R35.1
SCL_ESP  (via drill 0.51)
  Top 0.203: v30.5,4.26 29.94,3.7 27,3.7 26.7,4 26.7,6.3 27.25,6.85 R26.2 27.95,7 28.71,7 31.13,9.42 31.13,10.03 31.56,10.46 32.24,10.46 32.7,10 32.7,9.33 32.34,8.97 U4.23 | v45.7,4.7 44.4,3.4 42.6,3.4 v42.5,3.5
  Bottom 0.203: 31.26,3.5 32.18,2.58 H1.3 | 42.76,31.34 42.76,33.82 42.32,34.26 41.68,34.26 40.95,33.53 22.88,33.53 21.76,34.65 21.76,37.9 20.12,39.53 18.88,39.53 18,38.65 18,35.4 16.11,33.52 10.52,33.52 8.45,31.45 7.71,31.45 7.56,31.6 6.6,31.6 6,31 6,29.5 U$14.7 | 42.76,31.34 42.8,31.3 | 42.76,31.34 42.76,24.62 45.66,21.72 45.66,4.74 v45.7,4.7 | v42.5,3.5 31.26,3.5 | 31.26,3.5 v30.5,4.26
SDA_ESP  (via drill 0.51)
  Top 0.203: U4.24 31.83,9.76 v31.89,9.7 | v36.67,9.7 36.77,9.6 36.77,8.38 R36.2 36.85,7.65 36.7,7.5 36.7,5.8 36.8,5.7 38.7,5.7 40,4.4 v40,1.7
  Bottom 0.203: v36.67,9.7 v31.89,9.7 32.54,10.34 34.02,10.34 36.36,12.68 36.36,13.78 41.56,18.98 41.56,19.62 39.52,21.66 36.48,21.66 36.04,21.22 36.04,20.76 33.42,18.14 32.48,18.14 22.25,28.37 22.25,31.3 21.6,31.96 9.66,31.96 8.2,30.5 U$14.9 | v40,1.7 H1.4
TX-O  (via drill 0.51)
  Top 0.203: IC1.14 14.35,7.38 16.28,7.38 R25.2 16.1,6.6 v15.3,6.6
  Bottom 0.203: v15.3,6.6 14.8,6.1 13.1,6.1 12.7,6.5 7.3,6.5 3.9,9.9 3.9,13.1 3.3,13.7 3.3,22.5 5,24.2 U$14.4
TX-STAT
  Top 0.203: IC1.20 16.21,12.81 17.45,14.05 R37.2
VBAT  (via drill 0.51)
  Top 0.356: C14.1 14.89,21.81 15.1,21.6 15.1,19.5 15.5,19.1 20.8,19.1 21.1,19.4 21.1,21.17 U2.3 24.53,24.64 D1.C 24.65,25.01 R8.1 28.7,24.44 v28.7,23 | IC3.3 32.63,18.43 v33.1,18.9 | v33.1,18.9 33.1,19.49 34.73,21.12 34.73,21.13 37.3,23.7 R11.1 | R10.1 28.43,12.45 v28.74,12.76 | v33.3,16.1 33.3,18.7 v33.1,18.9
  Bottom 0.356: v33.1,18.9 29,23 v28.7,23 | v28.74,12.76 29.75,13.77 30.28,13.77 32.61,16.1 v33.3,16.1
VBATT_RAW
  Top 0.356: D1.A 21.86,32.1 15.93,32.1 13,35.03 J1.16 10.2,35.03 8.87,33.7 6.1,33.7 3.8,31.4 3.8,28.7 1.8,26.7 H3.1 0.5,24.7 0.5,17.3 0.9,16.9 4,16.9 4.5,17.4 4.5,18.2 5.9,19.6 8.1,19.6 8.73,18.97 R3.2
VCC  (via drill 0.51)
  Top 0.356: C10.1 48.35,20.25 46.4,18.3 U3.1 46.25,19.45 46.2,19.5 44.75,19.5 | 44.75,19.5 44.5,19.5 | 44.35,19.1 44.35,19.35 44.5,19.5 | 44.35,19.1 U3.3 44.35,18.05 | 41.95,20.95 C9.A 42.8,21.91 v42.8,22.7 | 41.95,20.95 43.41,19.5 44.1,19.5 | 44.1,19.5 44.5,19.5 | 44.35,19.1 44.1,19.35 44.1,19.5 | 44.35,19.1 44.75,19.5 | C17.1 11.3,23.08 R2.2 10.26,23.14 9.5,23.9 9.5,31.4 10.3,32.2 14.7,32.2 16.36,30.54 16.36,29.75 16.85,29.26 17.52,29.26 18.16,28.62 18.16,28.37 | R20.1 C17.1 | R24.1 20.59,2.32 22.22,2.32 23.5,3.6 24.43,3.6 Q7.2 25.59,6.09 27.1,7.6 28.7,7.6 30.7,9.6 v30.7,10.8 | v40.8,19.3 41.95,20.45 41.95,20.95 | C17.1 11.72,21.9 v11.5,21.9 | v18.7,21 18.8,21.1 U2.4 18.41,27.98 18.41,27.81 | 18.41,27.81 17.84,27.24 17.3,27.24 | 18.41,27.81 18.91,27.3 v26.9,27.3
  Bottom 0.356: v40.8,19.3 39.2,19.3 v30.7,10.8 | v18.7,21 16.8,19.1 14.3,19.1 v11.5,21.9 | v42.8,22.7 36.5,22.7 35.4,21.6 32.7,21.6 27,27.3 v26.9,27.3

### Text on the board
tPlace: RX | TX | OBDRX | OBDTX | SAYMOSTHASFAR